# EAGLE design Adafruit 0.96in 128x64 OLED STEMMA QT (EAGLE 9.5.0)
COMPANY: ADAFRUIT INDUSTRIES; DRAWN: KTOWN; REV: A
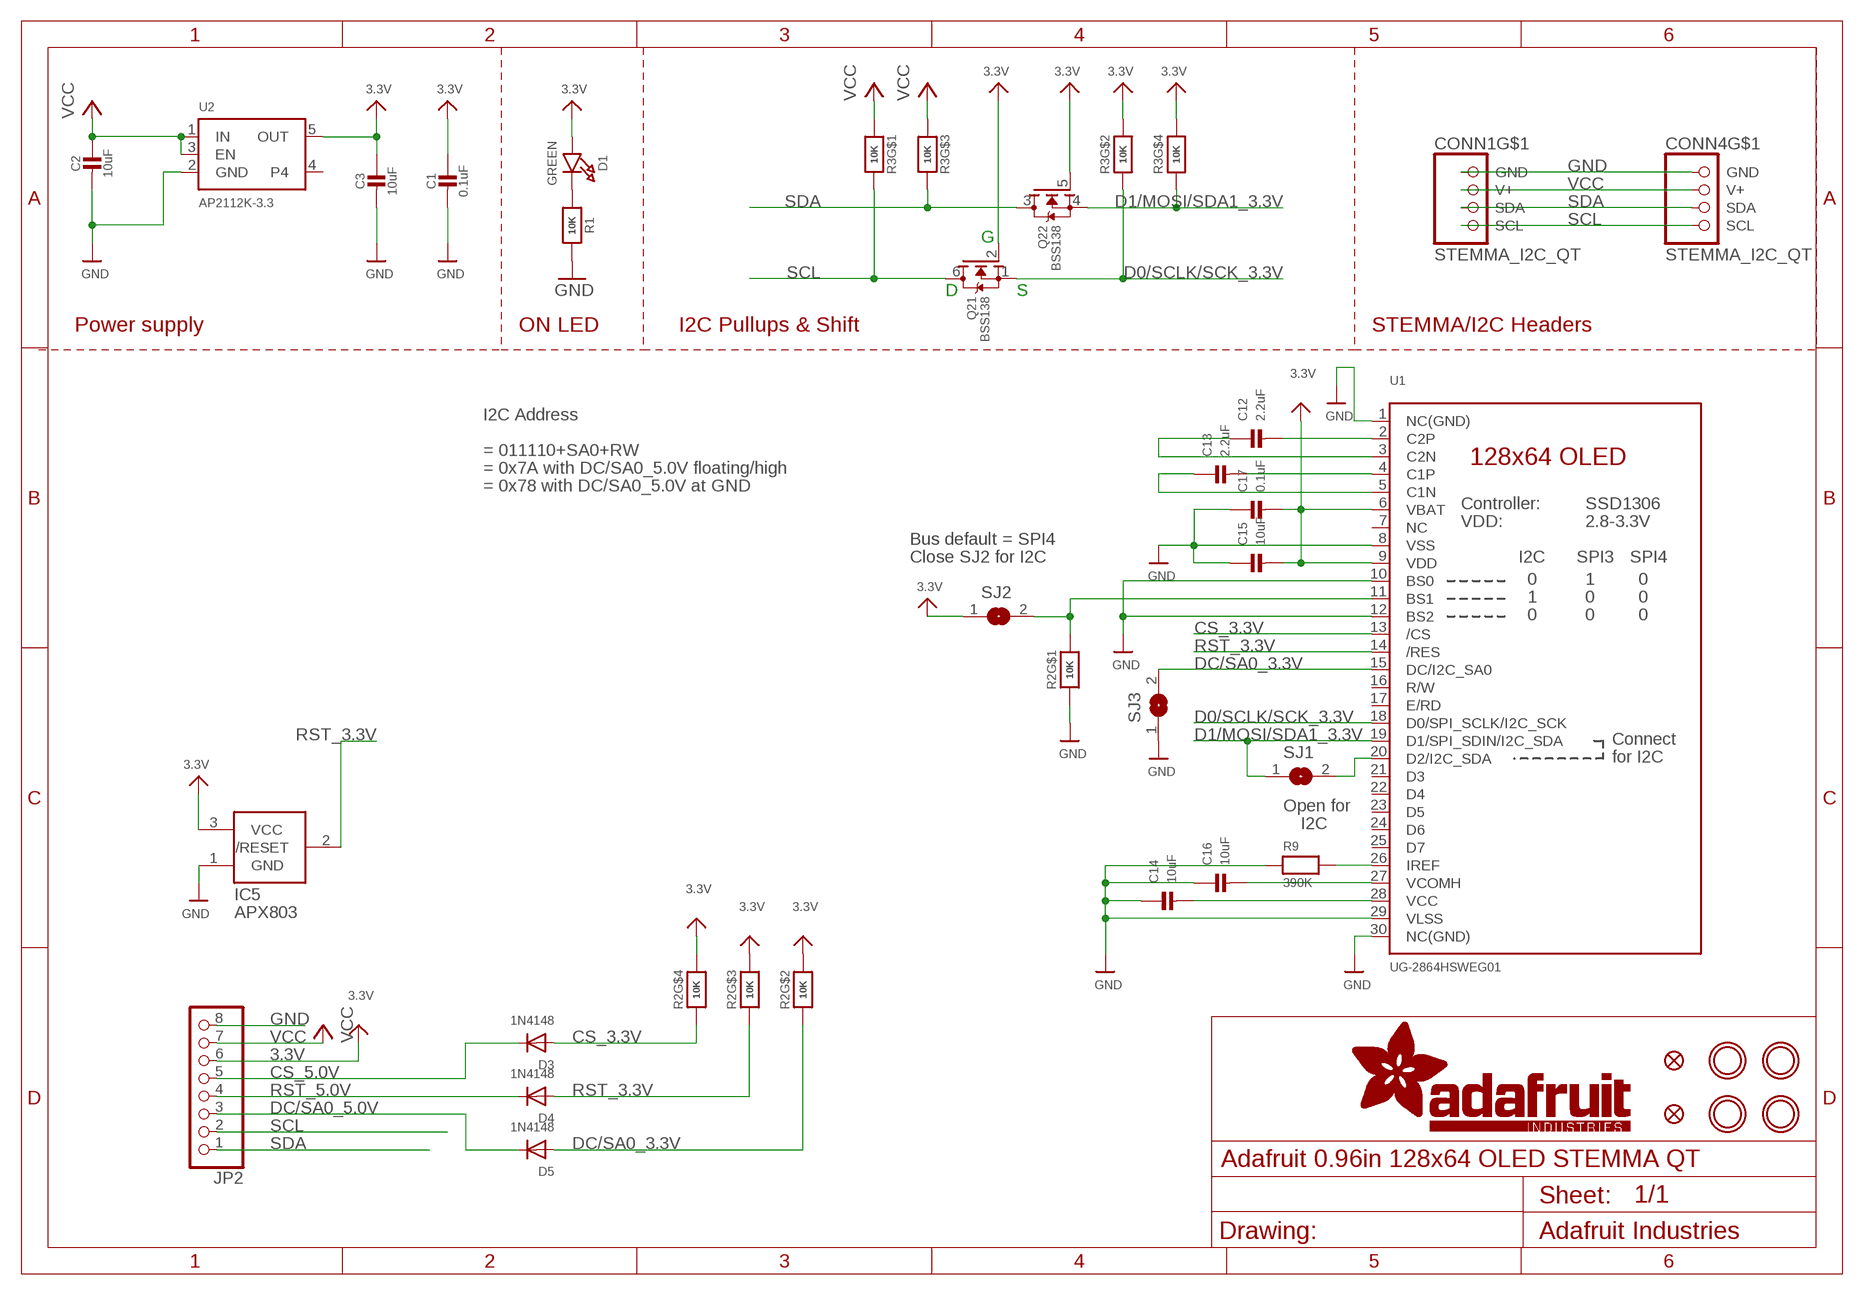
[diagram p0: schematic, sheet 1]

## Parts
C1  0.1uF  CAP_CERAMIC0603_NO  [0603-NO]
C2  10uF  CAP_CERAMIC0805-NOOUTLINE  [0805-NO]
C3  10uF  CAP_CERAMIC0805-NOOUTLINE  [0805-NO]
C12  2.2uF  CAP_CERAMIC0805-NOOUTLINE  [0805-NO]
C13  2.2uF  CAP_CERAMIC0805-NOOUTLINE  [0805-NO]
C14  10uF  CAP_CERAMIC0805-NOOUTLINE  [0805-NO]
C15  10uF  CAP_CERAMIC0805-NOOUTLINE  [0805-NO]
C16  10uF  CAP_CERAMIC0805-NOOUTLINE  [0805-NO]
C17  0.1uF  CAP_CERAMIC0603_NO  [0603-NO]
CONN1  STEMMA_I2C_QT  [JST_SH4]
CONN4  STEMMA_I2C_QT  [JST_SH4]
D1  GREEN  LED0603_NOOUTLINE  [CHIPLED_0603_NOOUTLINE]
D3  1N4148  DIODESOD-323  [SOD-323]
D4  1N4148  DIODESOD-323  [SOD-323]
D5  1N4148  DIODESOD-323  [SOD-323]
FID3  FIDUCIAL_1MM  [FIDUCIAL_1MM]
FID4  FIDUCIAL_1MM  [FIDUCIAL_1MM]
IC5  APX803  AXP083-SAG  [SOT23]
JP2  HEADER-1X870MIL  [1X08_ROUND_70]
Q2  BSS138  MOSFET-N_DUAL  [SOT363]
R1  10K  RESISTOR_0603_NOOUT  [0603-NO]
R2  10K  RESISTOR_4PACK  [RESPACK_4X0603]
R3  10K  RESISTOR_4PACK  [RESPACK_4X0603]
R9  390K  RESISTOR_0603_NOOUT  [0603-NO]
SJ1  SOLDERJUMPERCLOSED  [SOLDERJUMPER_CLOSEDWIRE]
SJ2  SOLDERJUMPERCLOSED  [SOLDERJUMPER_CLOSEDWIRE]
SJ3  SOLDERJUMPER  [SOLDERJUMPER_ARROW_NOPASTE]
U1  UG-2864HSWEG01  DISP_OLED_UG-2864HSWEG010.96"  [UG-2864HSWEG01_0.96IN_WRAPAROUND]
U2  AP2112K-3.3  VREG_SOT23-5  [SOT23-5]
U$1  MOUNTINGHOLE2.5  [MOUNTINGHOLE_2.5_PLATED]
U$17  MOUNTINGHOLE2.5  [MOUNTINGHOLE_2.5_PLATED]
U$19  MOUNTINGHOLE2.5  [MOUNTINGHOLE_2.5_PLATED]
U$21  MOUNTINGHOLE2.5  [MOUNTINGHOLE_2.5_PLATED]

## Nets
3.3V: C1.1 C3.1 C15.2 C17.2 D1.A IC5.3(VCC) JP2.6 Q2.2(1:G) Q2.5(2:G) R2.5 R2.6 R2.7 R3.2 R3.4 SJ2.1 U1.6(VBAT) U1.9(VDD) U2.5(OUT)
CS_3.3V: D3.A R2.4 U1.13(/CS)
CS_5.0V: D3.C JP2.5
D0/SCLK/SCK_3.3V: Q2.1(1:S) R3.7 U1.18(D0/SPI_SCLK/I2C_SCK)
D1/MOSI/SDA1_3.3V: Q2.4(2:S) R3.5 SJ1.1 U1.19(D1/SPI_SDIN/I2C_SDA)
DC/SA0_3.3V: D5.A R2.2 SJ3.2 U1.15(DC/I2C_SA0)
DC/SA0_5.0V: D5.C JP2.3
GND: C1.2 C2.2 C3.2 C14.1 C15.1 C16.1 C17.1 CONN1.1(GND) CONN4.1(GND) IC5.1(GND) JP2.8 R1.2 R2.1 R9.1 SJ3.1 U1.1(NC(GND)) U1.8(VSS) U1.10(BS0) U1.12(BS2) U1.29(VLSS) U1.30(NC(GND)) U2.2(GND)
N$2: D1.C R1.1
N$9: R2.8 SJ2.2 U1.11(BS1)
N$10: R9.2 U1.26(IREF)
N$11: C12.2 U1.2(C2P)
N$12: C12.1 U1.3(C2N)
N$13: C13.2 U1.4(C1P)
N$14: C13.1 U1.5(C1N)
N$15: C14.2 U1.28(VCC)
N$16: C16.2 U1.27(VCOMH)
N$17: SJ1.2 U1.20(D2/I2C_SDA)
RST_3.3V: D4.A IC5.2(/RESET) R2.3 U1.14(/RES)
RST_5.0V: D4.C JP2.4
SCL: CONN1.4(SCL) CONN4.4(SCL) JP2.2 Q2.6(1:D) R3.8
SDA: CONN1.3(SDA) CONN4.3(SDA) JP2.1 Q2.3(2:D) R3.6
VCC: C2.1 CONN1.2(V+) CONN4.2(V+) JP2.7 R3.1 R3.3 U2.1(IN) U2.3(EN)
Unconnected: CONN1.MT1(MT) CONN1.MT2(MT) CONN4.MT1(MT) CONN4.MT2(MT) U1.7(NC) U1.16(R/W) U1.17(E/RD) U1.21(D3) U1.22(D4) U1.23(D5) U1.24(D6) U1.25(D7) U2.4

## Notes on the sheet
- G
- D | S
- Power supply | ON LED | I2C Pullups & Shift | STEMMA/I2C Headers
- I2C Address
- = 011110+SA0+RW
- = 0x7A with DC/SA0_5.0V floating/high
- = 0x78 with DC/SA0_5.0V at GND
- Bus default = SPI4
- Close SJ2 for I2C
- Open for
- I2C

## Library data of the parts
C1-C3 C12-C17 = microbuilder:CAP_CERAMIC: Ceramic Capacitors For new designs, use the packages preceded by an '_' character since they are more reliable: The following footprints should be used on most boards: _0402 - Standard footprint for regular board layouts _0603 - Standard footprint for regular board layouts _0805 - Standard footprint for regular board layouts _1206 - Standard footprint for regular board layouts For extremely tight-pitch boards where space is at a premium, the following 'micro-pitch' footprints can be used (smaller pads, no silkscreen outline, etc.): _0402MP - Micro-pitch footprint for very dense/compact boards _0603MP - Micro-pitch footprint for very dense/compact boards _0805MP - Micro-pitch footprint for very dense/compact boards _1206MP - Micro-pitch footprint for very dense/compact boards
CONN1 CONN4 = microbuilder:STEMMA_I2C
D1 = microbuilder:LED: LED 0603 - 0603 Surface Mount Package 2mA: Green LED - Low Power (3.9mcd, 2ma, 1.7Vf) - Digikey: 475-2709-2-ND Orange LED - Low Power (9.8mcd, 2ma, 1.8Vf) - Digikey: 475-1194-2-ND Red LED - Low Power (5mcd, 2ma, 1.8Vf) - Digikey: 475-1195-2-ND Yellow LED - Low Power (7mcd, 2ma, 1.8Vf) - Digikey: 475-1196-2-ND 5mA: Blue LED - Low Power (17mcd, 5ma, 2.9Vf) - Digikey: LNJ937W8CRACT-ND 0805 - 0805 Surface Mount Package 2mA: Red LED (8.8mcd, 2mA, 1.8Vf, Clear) - Low Power [Digikey: 475-2510-1-ND] Green LED (5mcd, 2mA, 1.8Vf, Clear) - Low Power [Digikey: 475-2730-1-ND] Yellow LED (11.3mcd, 2mA, 1.8Vf, Clear) - Low Power [Digikey: 475-2555-1-ND] 20mA: Red LED (104mcd, 20mA, Diffused) - LS R976 [Digikey: 475-1278-6-ND] Red LED (12mcd, 20mA, 2.0Vf, Clear) - APT2012EC [Digikey: 754-1128-1-ND] Green LED (15mcd, 20mA, 2.2Vf, Clear) - APT2012GC [Digikey: 754-1131-1-ND] Orange LED (160mcd, 20mA, 2.1Vf, Clear) - APT2012SECK [Digikey: 754-1130-1-ND] 1206 - 1206 Surface Mount Package Green LED (26mcd, 20mA, Diffused) - LG N971 [Digikey: 475-1407-6-ND] Red LED (15mcd, 20mA, Diffused) - LH N974 [Digikey: 475-1416-6-ND] Cree - Cree High-Power Surface Mount LEDs XPEBWT-L1-0000-00D50 - White 111lm 350mA 2.9Vf 6200K 110° XTEAWT-00-0000-00000LEE3 - White 114lm 350mA 2.85Vf 5000K 115° Everlight - Everlight 45-21 Series Surface Mount LEDs 45-21/QK2C-B2832AC2CB2/2T - Warm White 2000mcd 20mA 3.25Vf 3050K 120° 45-21/LK2C-B38452C4CB2/2T - Nuetral White 2000mcd 20mA 3.25Vf 4150K 120° 45-21/LK2C-B50634C6CB2/2T - Cold White 2200mcd 20mA 3.25Vf 5650K 120° PLCC2 Reverse Mount LS T77K-J1L2-1-0-2-R18-Z - Red 11.25mcd 2mA 1.8Vf 630nm 120° LO T77K-L1M2-24-Z - Orange 19.6mcd 2mA 1.8Vf 606nm 120° LY T77K-K2M1-26-Z - Yellow 15.7mcd 2mA 1.8Vf 587nm 120°
D3-D5 = microbuilder:DIODE: Diode SMA Model Volts Amps Type Vf Ir Digikey # Notes SSA34-E3 40V 3A Schottky 480mV @ 3A 200uA @ 40V SSA34-E3/61TGITR-ND CDBA120-G 20V 1A Schottky 500mV @ 1A 500uA @ 20V 641-1014-6-ND REEL MBRA210 10V 2A Schottky 350mV @ 2A 700uA @ 10V MBRA210LT3 SOD-123 Model Volts Amps Type Vf Ir Order # Notes BAT54T1G 30V 200mA Schottky 800mV @ 200mA 2uA @ 25V BAT54T1GOSTR-ND B0530W 30V 500mA Schottky 430mV @ 500mA 130uA @ 30V B0530W-FDICT-ND REEL MBR120 20V 1A Schottky 340mV @ 1A MBR120VLSFT1GOSCT-ND SOD-323 Model Volts Amps Type Vf Ir Order # Notes PMEG2005EJ 20V 500mA Schottky 355mV @ 500mA 568-4110-1-ND ZLLS410 10V 570mA Schottky 380mV @ 570mA ZLLS410CT-ND 1N4148WS 75V 150mA Silicon/Simple 1V 1N4148WSFSCT-ND REEL SOD-523 Model Volts Amps Type Vf Ir Order # Notes BAT54XV2 30V 200mA Schottky 0.8V @ 100mA BAT54XV2CT-ND TB751S 30V 30mA Schottky RB751S-40TE61CT-ND SOT23-R/W (R = Solder Paste/Reflow Ovens, W = Hand-Soldering) Model Volts Amps Type Vf Ir Order # Notes BAT54FILM 40V 300mA Schottky 497-7162-1-ND POWERDI-5 Model Volts Amps Type Vf Ir Order # Notes PDS560 60V 5A Schottky 670mV @ 5A 150uA @ 60V PDS560DICT-ND
FID3 FID4 = microbuilder:FIDUCIAL: Fiducial Alignment Points Various fiducial points for machine vision alignment.; BOM: EXCLUDE
IC5 = adafruit:AXP083
JP2 = microbuilder:HEADER-1X8: PIN HEADER
Q2 = microbuilder:MOSFET-N_DUAL: Dual N-Channel MOSFET SOT363 (2.0x1.25mm) 2N7002PS - 60V, 320mA [Digikey: 568-5984-1-ND]
R1 R9 = microbuilder:RESISTOR: Resistors For new designs, use the packages preceded by an '_' character since they are more reliable: The following footprints should be used on most boards: _0402 - Standard footprint for regular board layouts _0603 - Standard footprint for regular board layouts _0805 - Standard footprint for regular board layouts _1206 - Standard footprint for regular board layouts For extremely tight-pitch boards where space is at a premium, the following 'micro-pitch' footprints can be used (smaller pads, no silkscreen outline, etc.): _0402MP - Micro-pitch footprint for very dense/compact boards _0603MP - Micro-pitch footprint for very dense/compact boards _0805MP - Micro-pitch footprint for very dense/compact boards _1206MP - Micro-pitch footprint for very dense/compact boards
R2 R3 = microbuilder:RESISTOR_4PACK: Resistor Packs (4 resistors) 4 x 0603 10K 1/16W - Digikey: YC164J-10KCT-ND
SJ1 SJ2 = microbuilder:SOLDERJUMPER: SMD Solder JUMPER Solder the two pads together to create a connection, or remove the solder to break it. REFLOW - Use this footprint for solder paste and reflow ovens. WAVE - Use this footprint for hand-soldering (larger pads). CLOSED - Has a trace between the two pads to ensure it is closed by default. The trace needs to be cut to disable the jumper, and can be closed again by creating a solder bridge between the two pads.
SJ3 = microbuilder:SOLDERJUMPER: SMD Solder JUMPER Solder the two pads together to create a connection, or remove the solder to break it. REFLOW - Use this footprint for solder paste and reflow ovens. WAVE - Use this footprint for hand-soldering (larger pads). CLOSED - Has a trace between the two pads to ensure it is closed by default. The trace needs to be cut to disable the jumper, and can be closed again by creating a solder bridge between the two pads.; BOM: EXCLUDE
U1 = adafruit_display:DISP_OLED_UG-2864HSWEG01: UG-2864HSWEG01 OLED display Both 1.3" and 0.96" models share the same FPC tab footprint, only the screen dimensions vary.
U2 = microbuilder:VREG_SOT23-5: SOT23-5 Fixed Voltage Regulators Part Current Out V Out V In V Dropout θJA (°C/W) TJ (°C) Digikey Part No. ADP121 150mA 3.3V 3.4-5.5V 0.09V @ 150mA -- -- ADP121-AUJZ33R7CT-ND ADP121 150mA 3.0V 3.1-5.5V 0.09V @ 150mA -- -- ADP121-AUJZ30R7CT-ND ADP122 300mA 3.3V 3.4-5.5V 0.085V @ 300mA -- -- ADP122AUJZ-3.3-R7CT-ND ADP1712 300mA 3.3V 3.5-5.5V 0.17V @ 300mA -- -- ADP1712AUJZ-3.3-R7TR-ND AP7311 (Low Cost) 150mA 3.3V 3.5-6V 0.15V @ 150mA -- -- AP7311-33WG-7DICT-ND LD39015M18R 150mA 1.8V 1.9V-5.5V 0.08V @ 100mA -- -- 497-6977-1-ND LP2985A-33DBVR 150mA 3.3V 3.3-16V 0.28V @ 150mA 206 150 296-18479-1-ND MCP1824T-3302E/OT 300mA 3.3V 3.5V-6V 0.2V @ 300mA -- -- MCP1824T-3302E/OTCT-ND MIC5205-2.5YM5 TR 150mA 2.5V 2.7-16V 0.165V @ 150mA -- -- 576-1257-2-ND MIC5205-3.0YM5 TR 150mA 3.0V 3.2V-16V 0.165V @ 150mA -- -- 576-1258-2-ND MIC5205-3.3YM5 TR 150mA 3.3V 3.5V-16V 0.165V @ 150mA -- -- 576-1259-2-ND TPS780330220 150mA 3.3V+2.2V 3.6-5.5V 250mV Max -- -- 296-23332-1-ND TDA3663/N1,135 100mA 3.3V 3.5-45V 0.18V @ 50mA -- -- 568-5343-1-ND Max operating temp can be calculated using θJA, TJ (max junction temperature), and power in watts. Set the "Maximum Ambient Temperature" until it reaches TJ ("Max Junction Temperature"), which is the absolute limit for safe use of the regulator: Heat Sink Temperature Calculator <http://www.daycounter.com/Calculators/Heat-Sink-Temperature-Calculator.phtml> For example, With 12V source into a 3.3V LP2985 and a 30mA load, we are dissipating (12V-3.3V) * 0.03A = 0.261W. With a θJA of 206 °C/W, a TJ of 150°C, and 261mW we can safely use the chip without a heat sink up to 75°C (=147.1°C Junction Temperature).
U$1 U$17 U$19 U$21 = microbuilder:MOUNTINGHOLE: Mounting Hole For #2 screws (0.086"/2.18mm width, 0.094"/2.4mm hole) use 2.5mm; BOM: EXCLUDE

## Board
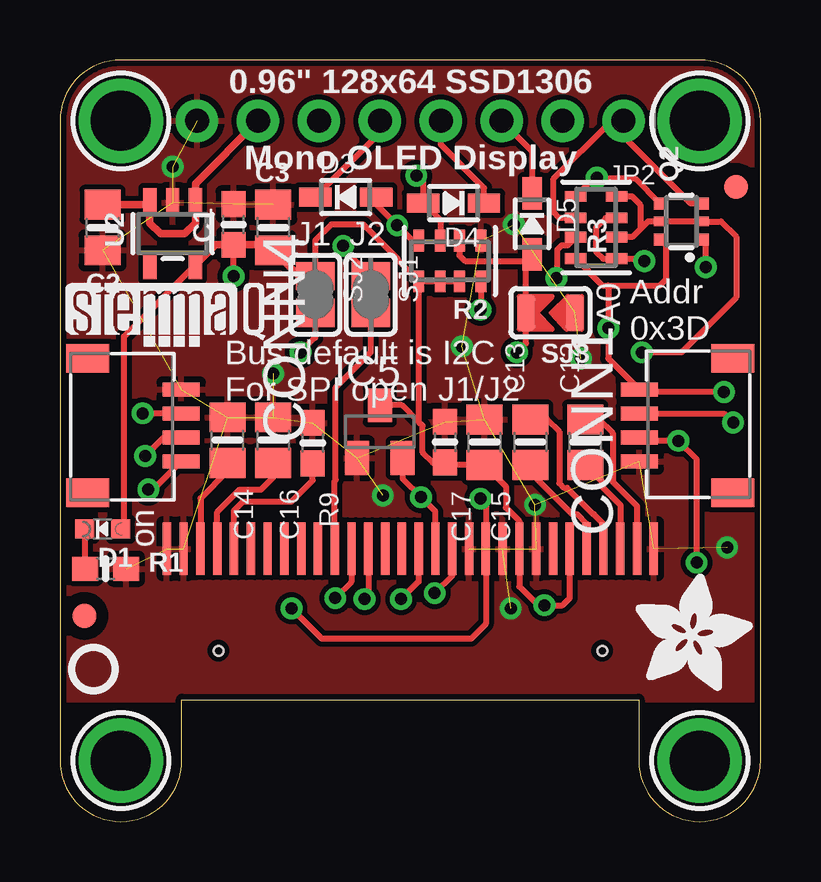
[diagram p1: board, top side]
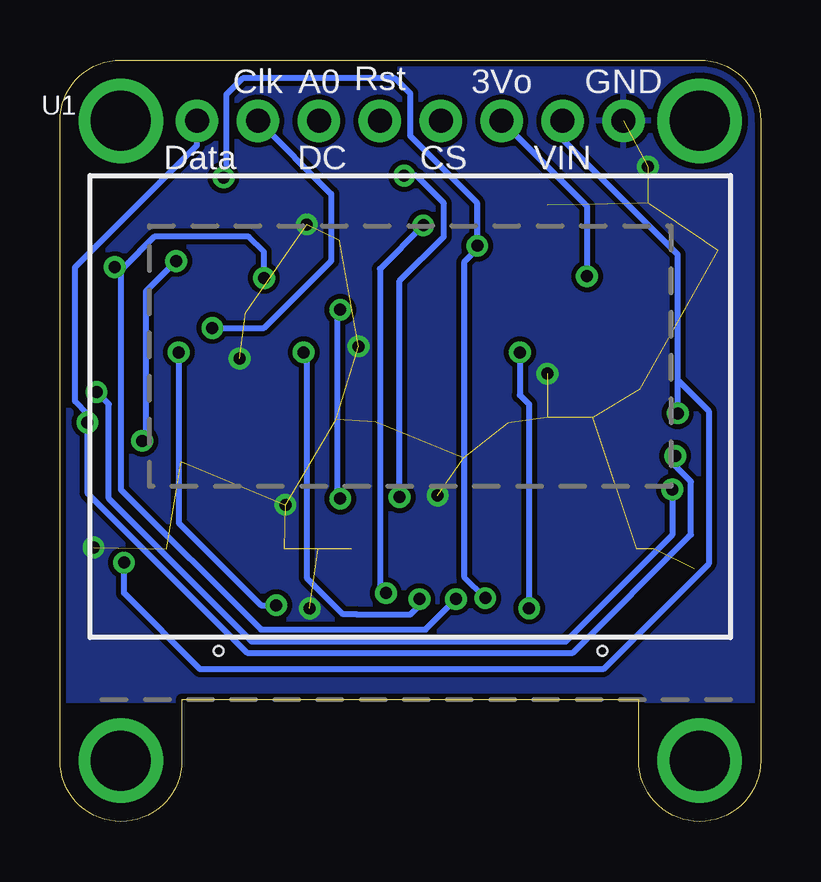
[diagram p2: board, bottom side, seen from below]

Size 29.21 x 31.75 mm. Coordinates in mm from the lower left corner, seen from the top.
Outline: 0,29.21 0,2.54 arc90 2.54,0 arc90 5.08,2.54 5.08,5.08 24.13,5.08 24.13,2.54 arc90 26.67,0 arc90 29.21,2.54 29.21,29.21 arc90 26.67,31.75 2.54,31.75 arc90 0,29.21
Copper layers (1*16): Top 0.035mm / dielectric 1.5mm / Bottom 0.035mm
Design rules "adafruit *": minimum track width 8mil, minimum drill 15.5mil, track to track 8mil, track to pad 8mil, pad to pad 8mil, via to via 8mil, smd to smd 8mil, copper to edge 10mil, drill to drill 8mil, minimum pad ring 10mil, minimum via ring 8mil, stop-mask expansion 2mil, vias tented up to drill 20mil, thermal gap 10mil

### Footprints (pad centres in the part's own frame; a part is rotated, then mirrored left to right if it is on the bottom)
0603-NO = smd 1.075 x 1: 1 -0.85,0; 2 0.85,0
0805-NO = smd 1.24 x 1.5: 1 -0.95,0; 2 0.95,0
JST_SH4 = smd 0.6 x 1.55: 1 -1.5,2.514; 2 -0.5,2.514; 3 0.5,2.514; 4 1.5,2.514 | smd 1.2 x 1.8: MT1 -2.8,-1.386; MT2 2.8,-1.386
CHIPLED_0603_NOOUTLINE = smd 0.8 x 0.8: A 0,-0.75; C 0,0.75
SOD-323 = smd 1.35 x 0.8: A 1.27,0; C -1.27,0
FIDUCIAL_1MM = smd 1 x 1: 1 0,0
SOT23 = smd 1 x 1.4: 1 -0.95,-1.1; 2 0.95,-1.1; 3 0,1.1
1X08_ROUND_70 = drill 1 pad 1.778: 1 -8.89,0; 2 -6.35,0; 3 -3.81,0; 4 -1.27,0; 5 1.27,0; 6 3.81,0; 7 6.35,0; 8 8.89,0
SOT363 = smd 0.5 x 0.5: 1 -0.75,-0.9; 3 0.75,-0.9; 4 0.75,0.9; 6 -0.75,0.9 | smd 0.4 x 0.5: 2 0,-0.9; 5 0,0.9
RESPACK_4X0603 = smd 0.45 x 0.9: 1 -1.3,-0.85; 2 -0.4,-0.85; 3 0.4,-0.85; 4 1.3,-0.85; 5 1.3,0.85; 6 0.4,0.85; 7 -0.4,0.85; 8 -1.3,0.85
SOLDERJUMPER_CLOSEDWIRE = smd 1.168 x 1.6: 1 -0.762,0; 2 0.762,0 | smd 0.635 x 0.203: WIRE 0,0
SOLDERJUMPER_ARROW_NOPASTE = smd 0.762 x 1.524: 1 -1.016,0; 2 1.016,0
UG-2864HSWEG01_0.96IN_WRAPAROUND = smd 0.35 x 2.2 bottom: 1 -10.15,-1.2; 2 -9.45,-1.2; 3 -8.75,-1.2; 4 -8.05,-1.2; 5 -7.35,-1.2; 6 -6.65,-1.2; 7 -5.95,-1.2; 8 -5.25,-1.2; 9 -4.55,-1.2; 10 -3.85,-1.2; 11 -3.15,-1.2; 12 -2.45,-1.2; 13 -1.75,-1.2; 14 -1.05,-1.2; 15 -0.35,-1.2; 16 0.35,-1.2; 17 1.05,-1.2; 18 1.75,-1.2; 19 2.45,-1.2; 20 3.15,-1.2; 21 3.85,-1.2; 22 4.55,-1.2; 23 5.25,-1.2; 24 5.95,-1.2; 25 6.65,-1.2; 26 7.35,-1.2; 27 8.05,-1.2; 28 8.75,-1.2; 29 9.45,-1.2; 30 10.15,-1.2 | hole 0.4: -8,-5.45; 8,-5.45
SOT23-5 = smd 0.55 x 1.2: 1 -0.95,-1.3; 2 0,-1.3; 3 0.95,-1.3; 4 0.95,1.3; 5 -0.95,1.3
MOUNTINGHOLE_2.5_PLATED = drill 2.5 pad 3.2: P$1 0,0

### Placement (x,y rotation side)
C1  7.24,24.89 90 top
C2  1.78,24.77 270 top
C3  8.89,24.77 90 top
C12  21.9,15.81 90 top
C13  19.61,15.81 90 top
C14  6.99,15.9 270 top
C15  17.7,15.81 270 top
C16  8.89,15.9 270 top
C17  16.05,15.81 270 top
CONN1  26.67,16.51 90 top
CONN4  2.54,16.51 270 top
D1  1.78,12.19 90 top
D3  11.91,26.04 0 top
D4  16.41,25.78 180 top
D5  19.68,24.92 270 top
FID3  1.02,8.57 0 top
FID4  28.19,26.45 0 top
IC5  13.34,16.26 0 top
JP2  14.61,29.21 180 top
Q2  25.91,25.02 90 top
R1  1.91,10.54 0 top
R2  16.26,23.37 180 top
R3  22.35,24.77 90 top
R9  10.54,15.77 270 top
SJ1  12.96,21.97 270 top
SJ2  10.65,21.97 270 top
SJ3  20.45,21.21 180 top
U1  14.61,12.57 0 bottom
U2  4.7,24.51 180 top
U$1  2.54,29.21 0 top
U$8  [ADAFRUIT_5MM]  24,5.46 0 top
U$17  26.67,29.21 0 top
U$19  2.54,2.54 0 top
U$21  26.67,2.54 0 top
U$25  [PCBFEAT-REV-040]  1.4,6.35 0 top
U$31  [STEMMAQT]  0.25,19.81 0 top

### Tracks (layer width: path | path; a pad name or v marks a point on that pad's centre or on a via)
3.3V  (via drill 0.5)
  Top 0.254: D1.A 2.67,12.33 2.67,20.23 U2.5 | U1.6 21.25,9.32 20.95,9.02 v20.19,9.02 19.94,9.02 19.16,9.8 U1.9 19.16,12.52 18.59,13.09 18.59,13.97 C15.2 16.15,14.86 C17.2 15.54,14.96 15.12,15.39 15.12,16.5 14.96,16.66 | v7.24,22.73 C1.1 | 14.96,16.66 14.26,17.36 IC5.3 | R3.2 23.86,24.36 24.19,24.7 | 24.19,24.7 24.51,25.02 Q2.5 Q2.2 27.56,25.02 28.19,24.38 28.19,21.84 25.91,19.56 v24.26,19.56 | R3.4 23.85,26.07 24.19,25.72 24.19,24.7 | R2.5 14.96,16.66 | R2.5 R2.6 R2.7 | R2.5 14.09,23.38 14.09,23.45 12.65,24.89 11.3,24.89 10.64,24.23 SJ2.1
  Top 0.305: U2.5 6.48,24.04 C1.1 8.66,24.04 C3.1 9.97,22.73 SJ2.1
  Bottom 0.254: JP2.6 7.24,25.65 v7.24,22.73 | v24.26,19.56 24.26,12.45 20.83,9.02 v20.19,9.02
CS_3.3V  (via drill 0.5)
  Top 0.254: U1.13 16.36,10.26 v15.62,9.53 | R2.4 14.7,24.22 v14.06,24.86 13.18,25.73 D3.A
  Bottom 0.254: v15.62,9.53 15.88,9.78 15.88,23.04 v14.06,24.86
CS_5.0V
  Top 0.254: JP2.5 13.34,28.73 D3.C
D0/SCLK/SCK_3.3V  (via drill 0.5)
  Top 0.254: v12.7,9.27 12.7,9.47 12.86,9.31 U1.18 | v26.92,23.11 26.92,24.15 Q2.1 | R3.7 21.16,24.02 20.91,24.02 20.72,23.83 20.72,22.68 v20.7,22.66
  Bottom 0.254: v12.7,9.27 13.97,8 20.83,8 26.67,13.84 26.67,22.86 v26.92,23.11 26.54,23.11 25.27,24.38 21.34,24.38 20.7,23.75 v20.7,22.66
D1/MOSI/SDA1_3.3V  (via drill 0.5)
  Top 0.254: U1.19 12.15,10 v11.48,9.32 | v11.81,24 11.81,23.88 SJ1.1 | Q2.4 23.98,26.8 22.35,26.8 | R3.5 22.23,26.8 22.35,26.8 | v22.39,26.85 22.39,26.83 22.35,26.8
  Bottom 0.254: v11.48,9.32 12.37,10.21 12.37,23.32 11.81,23.88 v11.81,24 11.81,25.78 14.61,28.57 14.61,30.35 15.24,30.99 21.59,30.99 22.28,30.3 22.28,26.96 v22.39,26.85
DC/SA0_3.3V  (via drill 0.5)
  Top 0.254: R2.2 16.66,23.6 16.89,23.37 19.41,23.37 19.43,23.39 | 19.43,23.39 SJ3.2 19.43,19.94 v19.05,19.56 | 19.43,23.39 D5.A | U1.15 14.96,10 v14.22,9.27
  Bottom 0.254: v14.22,9.27 14.22,9.02 14.63,8.62 16.83,8.62 16.86,8.64 17.4,8.64 18.92,10.16 18.92,19.43 v19.05,19.56
DC/SA0_5.0V
  Top 0.254: JP2.3 19.68,27.94 D5.C
GND  (via drill 0.5)  (30 unrouted)
  other vias: 21.72,19.3 16.76,19.81 18.92,24.89 27.81,11.43 13.46,13.59 8.89,18.67 4.7,27.3 18.8,8.89 19.81,13.21
  pour Top: 0,31.62 29.21,31.62 29.21,5.08 0,5.08
  pour Bottom: 0,31.62 29.21,31.62 29.21,5.08 0,5.08
N$2
  Top 0.254: D1.C 1.03,10.57 R1.1
N$9  (via drill 0.5)
  Top 0.254: v9.65,8.89 10.92,7.62 17.14,7.62 17.75,8.23 U1.11 17.75,13.23 v17.53,13.46 | SJ2.2 10.64,20.17 v10.03,19.56 | R2.8 17.56,21.37 v17.53,21.34
  Bottom 0.254: v10.03,19.56 10.03,17.78 9.65,17.4 v9.65,8.89 | v17.53,21.34 17.65,21.21 17.65,13.59 v17.53,13.46
N$10
  Top 0.254: U1.26 7.25,12.96 7.63,13.34 9.65,13.34 10.54,14.22 R9.2
N$11
  Top 0.254: C12.2 22.48,16.76 23.05,16.19 23.05,14.16 24.05,13.16 U1.2
N$12
  Top 0.254: C12.1 22.59,14.17 22.59,13.97 23.37,13.2 23.37,11.39 U1.3
N$13
  Top 0.254: C13.2 20.31,16.76 20.82,16.26 20.82,14.11 21.01,13.91 21.14,13.91 22.25,12.8 22.27,12.8 22.66,12.41 U1.4
N$14
  Top 0.254: U1.5 21.95,12.41 21.57,12.8 21.36,12.8 19.61,14.55 C13.1
N$15
  Top 0.254: C14.2 6.99,14.61 5.86,13.47 U1.28
N$16
  Top 0.254: U1.27 6.55,12.9 7.49,13.84 8.38,13.84 8.89,14.35 C16.2
N$17
  Top 0.254: U1.20 11.46,14.21 11.5,14.25 11.5,18.1 12.96,19.57 SJ1.2
RST_3.3V  (via drill 0.5)
  Top 0.254: R2.3 15.86,25.06 D4.A 15.14,26.64 v14.86,26.92 | U1.14 15.65,12.92 v15.05,13.53 14.29,14.29 IC5.2
  Bottom 0.254: v15.05,13.53 15.05,22.54 13.21,24.38 13.21,25.78 14.35,26.92 v14.86,26.92
RST_5.0V
  Top 0.254: D4.C 17.68,26.42 15.88,28.22 JP2.4
SCL  (via drill 0.5)
  Top 0.254: R3.8 22.61,22.35 22.86,22.35 | Q2.6 25.27,24 25.27,22.61 25.02,22.35 22.86,22.35 | 22.86,22.35 v22.86,20.57 22.86,19.31 CONN1.4 24.26,17.91 v27.69,17.91 | CONN4.4 3.89,13.84 v3.68,13.84
  Bottom 0.254: JP2.2 17.91,26.16 17.91,23.37 20.7,20.57 v22.86,20.57 | v3.68,13.84 3.68,11.94 8.13,7.49 21.21,7.49 27.18,13.46 27.18,17.4 v27.69,17.91
SDA  (via drill 0.5)
  Top 0.254: Q2.3 26.3,25.77 23.5,28.57 23.5,29.08 | 23.5,29.08 JP2.1 | R3.6 20.81,25.16 20.57,25.4 20.57,26.8 22.86,29.08 23.5,29.08 | CONN1.3 27.69,17.01 v28.07,16.64 | v3.56,15.24 4.33,16.01 CONN4.3
  Bottom 0.254: v3.56,15.24 3.56,14.82 2.9,14.17 2.9,11.96 7.82,7.04 21.4,7.04 28.07,13.7 v28.07,16.64 28.07,17.02 28.57,17.53 28.57,23.11 23.5,28.19 JP2.1
VCC  (via drill 0.5)
  Top 0.254: CONN4.2 v3.46,17.01 v3.45,17.02 | R3.3 22.75,25.16 22.35,24.77 22.35,23.75 22.64,23.46 R3.1 24.36,23.46 v24.36,23.37 | CONN1.2 24.29,15.88 v25.78,15.88 26.54,15.11 v26.54,10.79
  Top 0.305: JP2.7 5.65,26.6 U2.1 5.65,24.95 5.21,24.51 4.19,24.51 3.75,24.95 U2.3 3.65,25.71 C2.1
  Bottom 0.254: v3.45,17.02 3.45,18.41 | 3.45,18.41 3.45,23.64 8.26,28.45 JP2.7 | v24.36,23.37 25.63,22.1 25.63,16.02 v25.78,15.88 | 3.45,18.41 2.16,17.12 2.16,10.75 6.56,6.35 23.37,6.35 26.54,9.53 v26.54,10.79

### Text on the board
tPlace: 0.96" 128x64 SSD1306 | Mono OLED Display | J1 | J2 | A0 | Addr / 0x3D | Bus default is I2C / For SPI open J1/J2 | on
bPlace: GND | 3Vo | Rst | A0 | Clk | VIN | CS | DC | Data